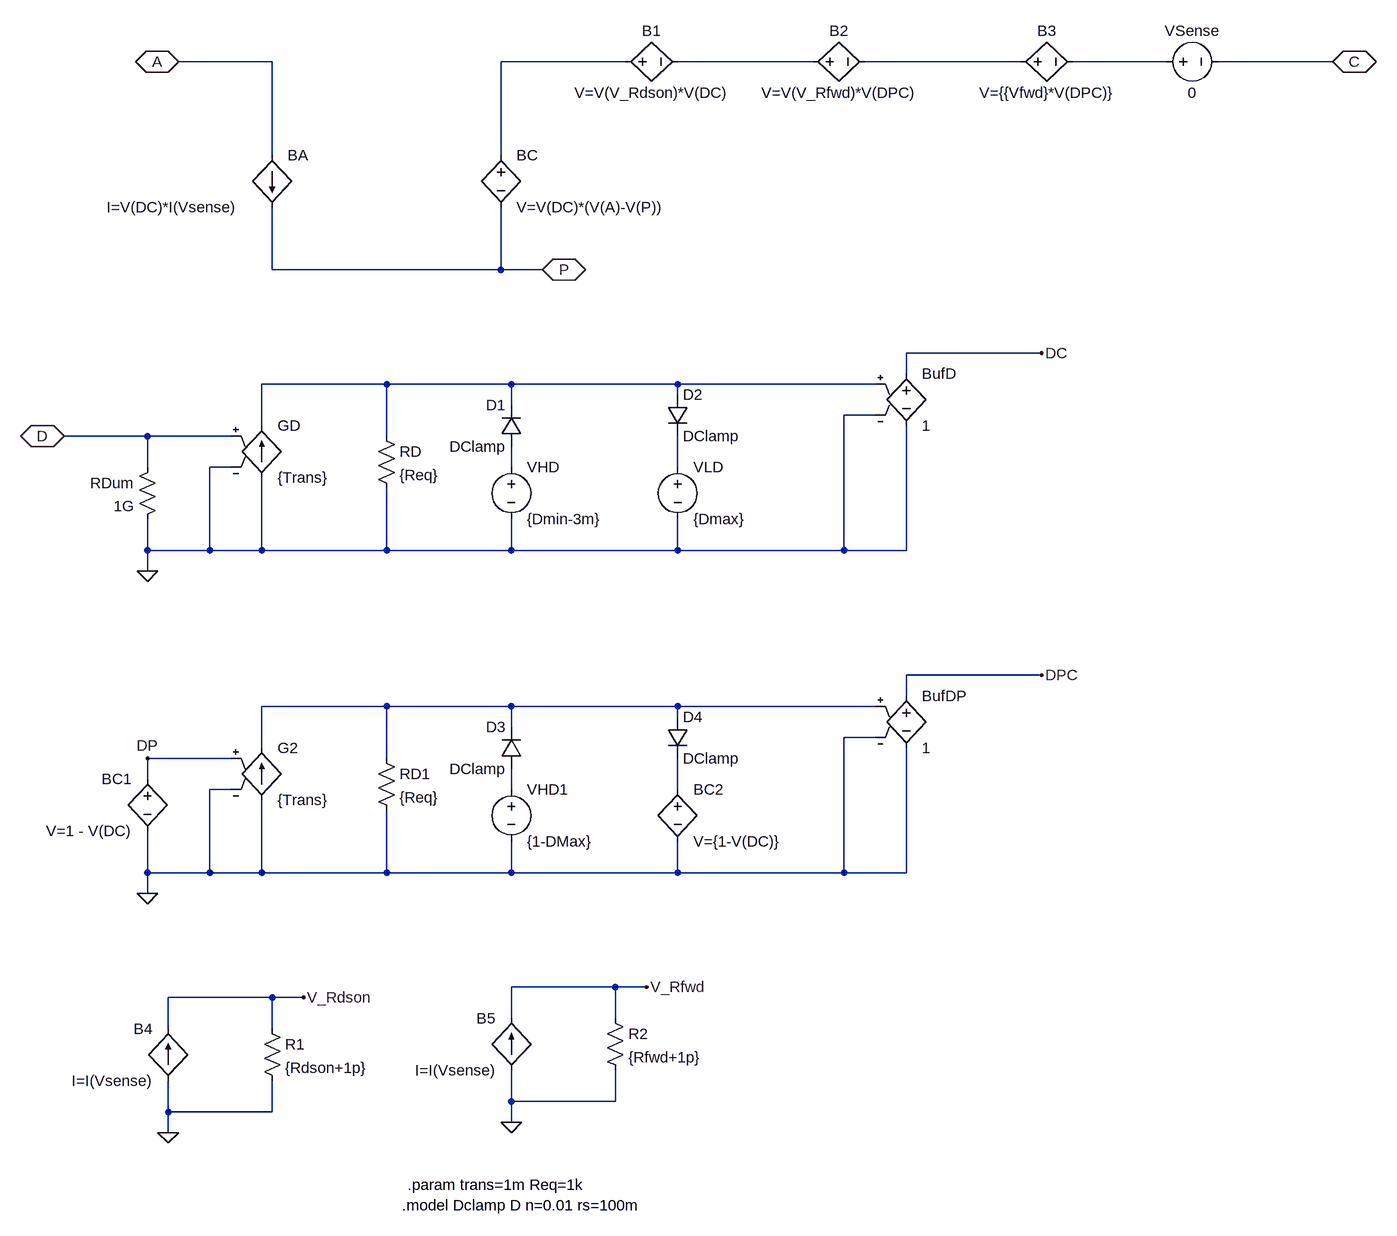
[diagram p0: schematic PWM_SW_VM_Lossy_CCM.asc]
PWM_SW_VM_Lossy_CCM.asc, the LTspice schematic file:
Version 4.1
SHEET 1 2180 2052
WIRE -48 -48 -192 -48
WIRE 496 -48 304 -48
WIRE 784 -48 576 -48
WIRE 1104 -48 864 -48
WIRE 1328 -48 1184 -48
WIRE 1584 -48 1408 -48
WIRE -48 96 -48 -48
WIRE 304 96 304 -48
WIRE -48 272 -48 176
WIRE 304 272 304 176
WIRE 304 272 -48 272
WIRE 368 272 304 272
WIRE 1136 400 928 400
WIRE 928 432 928 400
WIRE 128 448 -64 448
WIRE 320 448 128 448
WIRE 576 448 320 448
WIRE 880 448 576 448
WIRE 576 464 576 448
WIRE 320 480 320 448
WIRE 880 496 832 496
WIRE -64 512 -64 448
WIRE -240 528 -368 528
WIRE -112 528 -240 528
WIRE 128 528 128 448
WIRE -240 576 -240 528
WIRE -112 576 -144 576
WIRE 320 576 320 544
WIRE 576 576 576 528
WIRE -240 704 -240 656
WIRE -144 704 -144 576
WIRE -144 704 -240 704
WIRE -64 704 -64 592
WIRE -64 704 -144 704
WIRE 128 704 128 608
WIRE 128 704 -64 704
WIRE 320 704 320 656
WIRE 320 704 128 704
WIRE 576 704 576 656
WIRE 576 704 320 704
WIRE 832 704 832 496
WIRE 832 704 576 704
WIRE 928 704 928 512
WIRE 928 704 832 704
WIRE -240 736 -240 704
WIRE 1136 896 928 896
WIRE 928 928 928 896
WIRE 128 944 -64 944
WIRE 320 944 128 944
WIRE 576 944 320 944
WIRE 880 944 576 944
WIRE 576 960 576 944
WIRE 320 976 320 944
WIRE 880 992 832 992
WIRE -64 1008 -64 944
WIRE -112 1024 -240 1024
WIRE 128 1024 128 944
WIRE -240 1056 -240 1024
WIRE -112 1072 -144 1072
WIRE 320 1072 320 1040
WIRE 576 1072 576 1024
WIRE -240 1200 -240 1136
WIRE -144 1200 -144 1072
WIRE -144 1200 -240 1200
WIRE -64 1200 -64 1088
WIRE -64 1200 -144 1200
WIRE 128 1200 128 1104
WIRE 128 1200 -64 1200
WIRE 320 1200 320 1152
WIRE 320 1200 128 1200
WIRE 576 1200 576 1152
WIRE 576 1200 320 1200
WIRE 832 1200 832 992
WIRE 832 1200 576 1200
WIRE 928 1200 928 1008
WIRE 928 1200 832 1200
WIRE -240 1232 -240 1200
WIRE 480 1376 320 1376
WIRE 528 1376 480 1376
WIRE -48 1392 -208 1392
WIRE 0 1392 -48 1392
WIRE 320 1424 320 1376
WIRE 480 1424 480 1376
WIRE -208 1440 -208 1392
WIRE -48 1440 -48 1392
WIRE 320 1552 320 1504
WIRE 480 1552 480 1504
WIRE 480 1552 320 1552
WIRE -208 1568 -208 1520
WIRE -48 1568 -48 1520
WIRE -48 1568 -208 1568
WIRE 320 1584 320 1552
WIRE -208 1600 -208 1568
FLAG -240 736 0
FLAG -240 1232 0
FLAG 1136 400 DC
FLAG 1136 896 DPC
FLAG -368 528 D
IOPIN -368 528 BiDir
FLAG 0 1392 V_Rdson
FLAG -208 1600 0
FLAG 528 1376 V_Rfwd
FLAG 320 1584 0
FLAG -192 -48 A
IOPIN -192 -48 BiDir
FLAG 368 272 P
IOPIN 368 272 BiDir
FLAG 1584 -48 C
IOPIN 1584 -48 BiDir
FLAG -240 1024 DP
SYMBOL bv 304 80 R0
SYMATTR InstName BC
SYMATTR Value V=V(DC)*(V(A)-V(P))
SYMBOL bi -48 96 R0
WINDOW 3 -255 80 Left 2
SYMATTR InstName BA
SYMATTR Value I=V(DC)*I(Vsense)
SYMBOL bv 480 -48 R270
WINDOW 0 32 56 VTop 2
WINDOW 3 -32 56 VBottom 2
SYMATTR InstName B1
SYMATTR Value V=V(V_Rdson)*V(DC)
SYMBOL bv 768 -48 R270
WINDOW 0 32 56 VTop 2
WINDOW 3 -32 56 VBottom 2
SYMATTR InstName B2
SYMATTR Value V=V(V_Rfwd)*V(DPC)
SYMBOL bv 1088 -48 R270
WINDOW 0 32 56 VTop 2
WINDOW 3 -32 56 VBottom 2
SYMATTR InstName B3
SYMATTR Value V={{Vfwd}*V(DPC)}
SYMBOL voltage 1312 -48 R270
WINDOW 0 32 56 VTop 2
WINDOW 3 -32 56 VBottom 2
WINDOW 123 0 0 Left 0
WINDOW 39 0 0 Left 0
SYMATTR InstName VSense
SYMATTR Value 0
SYMBOL g -64 496 R0
SYMATTR InstName GD
SYMATTR Value {Trans}
SYMBOL e 928 416 R0
SYMATTR InstName BufD
SYMATTR Value 1
SYMBOL voltage 320 560 R0
WINDOW 123 0 0 Left 0
WINDOW 39 0 0 Left 0
SYMATTR InstName VHD
SYMATTR Value {Dmin-3m}
SYMBOL voltage 576 560 R0
WINDOW 123 0 0 Left 0
WINDOW 39 0 0 Left 0
SYMATTR InstName VLD
SYMATTR Value {Dmax}
SYMBOL diode 336 544 R180
WINDOW 0 24 64 Left 2
WINDOW 3 24 0 Left 2
SYMATTR InstName D1
SYMATTR Value DClamp
SYMBOL diode 560 464 R0
SYMATTR InstName D2
SYMATTR Value DClamp
SYMBOL res -224 560 M0
SYMATTR InstName RDum
SYMATTR Value 1G
SYMBOL res 112 512 R0
SYMATTR InstName RD
SYMATTR Value {Req}
SYMBOL g -64 992 R0
SYMATTR InstName G2
SYMATTR Value {Trans}
SYMBOL e 928 912 R0
SYMATTR InstName BufDP
SYMATTR Value 1
SYMBOL voltage 320 1056 R0
WINDOW 123 0 0 Left 0
WINDOW 39 0 0 Left 0
SYMATTR InstName VHD1
SYMATTR Value {1-DMax}
SYMBOL diode 336 1040 R180
WINDOW 0 24 64 Left 2
WINDOW 3 24 0 Left 2
SYMATTR InstName D3
SYMATTR Value DClamp
SYMBOL diode 560 960 R0
SYMATTR InstName D4
SYMATTR Value DClamp
SYMBOL res 112 1008 R0
SYMATTR InstName RD1
SYMATTR Value {Req}
SYMBOL bv -240 1040 M0
SYMATTR InstName BC1
SYMATTR Value V=1 - V(DC)
SYMBOL bi -208 1520 R180
WINDOW 0 24 80 Left 2
WINDOW 3 24 0 Left 2
SYMATTR InstName B4
SYMATTR Value I=I(Vsense)
SYMBOL res -64 1424 R0
SYMATTR InstName R1
SYMATTR Value {Rdson+1p}
SYMBOL bi 320 1504 R180
WINDOW 0 24 80 Left 2
WINDOW 3 24 0 Left 2
SYMATTR InstName B5
SYMATTR Value I=I(Vsense)
SYMBOL res 464 1408 R0
SYMATTR InstName R2
SYMATTR Value {Rfwd+1p}
SYMBOL bv 576 1056 R0
SYMATTR InstName BC2
SYMATTR Value V={1-V(DC)}
TEXT 152 1712 Left 2 !.model Dclamp D n=0.01 rs=100m
TEXT 160 1680 Left 2 !.param trans=1m Req=1k

The netlist it stands for:
* PWM_SW_VM_Lossy_CCM.asc
BC N001 P V=V(DC)*(V(A)-V(P))
BA A P I=V(DC)*I(Vsense)
B1 N001 N002 V=V(V_Rdson)*V(DC)
B2 N002 N003 V=V(V_Rfwd)*V(DPC)
B3 N003 N004 V={{Vfwd}*V(DPC)}
VSense N004 C 0
GD 0 N005 D 0 {Trans}
E§BufD DC 0 N005 0 1
VHD N006 0 {Dmin-3m}
VLD N007 0 {Dmax}
D1 N006 N005 DClamp
D2 N005 N007 DClamp
RDum D 0 1G
RD N005 0 {Req}
G2 0 N008 DP 0 {Trans}
E§BufDP DPC 0 N008 0 1
VHD1 N009 0 {1-DMax}
D3 N009 N008 DClamp
D4 N008 N010 DClamp
RD1 N008 0 {Req}
BC1 DP 0 V=1 - V(DC)
B4 0 V_Rdson I=I(Vsense)
R1 V_Rdson 0 {Rdson+1p}
B5 0 V_Rfwd I=I(Vsense)
R2 V_Rfwd 0 {Rfwd+1p}
BC2 N010 0 V={1-V(DC)}
.model D D
.lib standard.dio
.model Dclamp D n=0.01 rs=100m
.param trans=1m Req=1k
.backanno
.end